# EAGLE design TaaraWeMosBase3 (EAGLE 9.6.2)
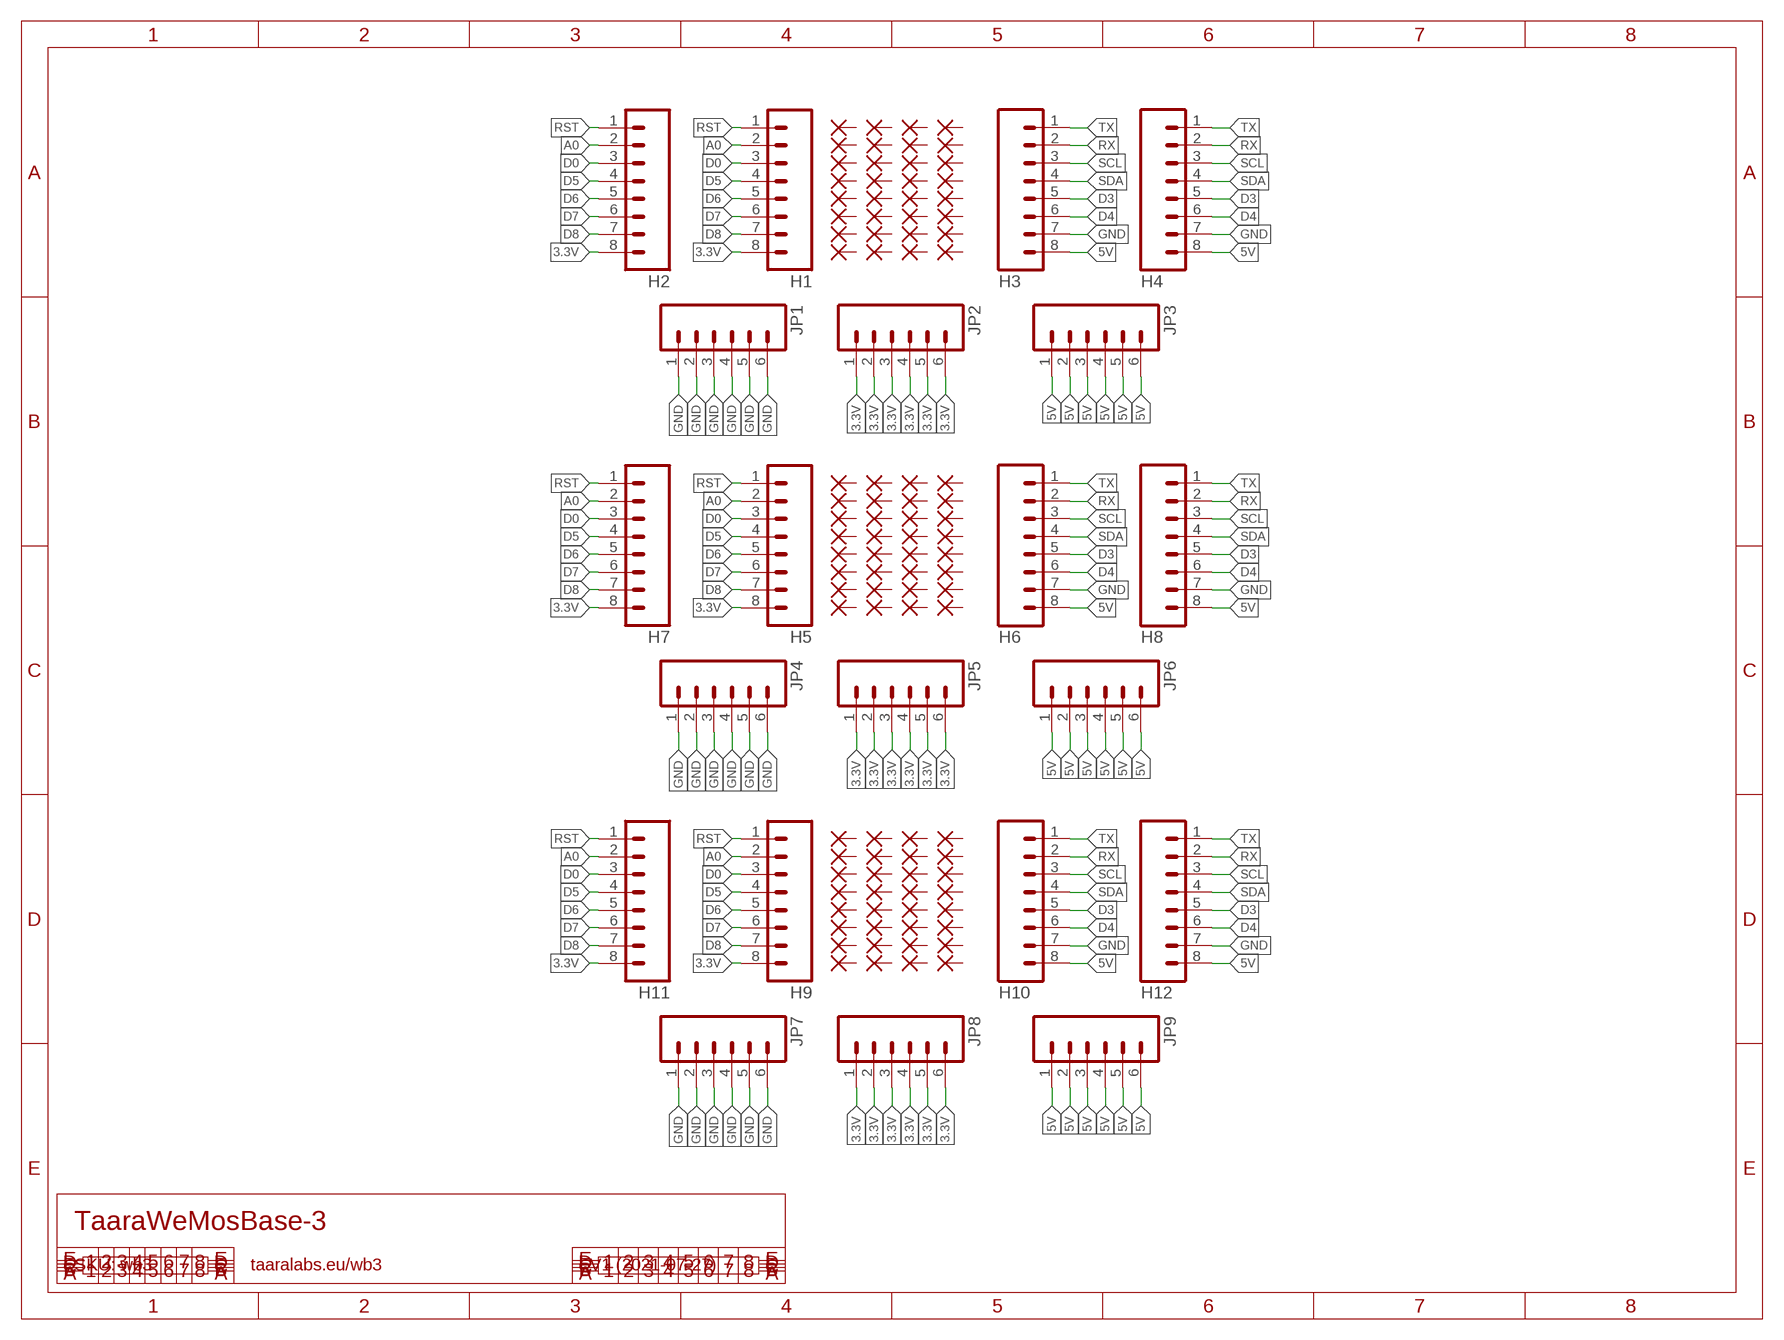
[diagram p0: schematic, sheet 1]

## Parts
H1  M08  [1X08]
H2  M08  [1X08]
H3  M08  [1X08]
H4  M08  [1X08]
H5  M08  [1X08]
H6  M08  [1X08]
H7  M08  [1X08]
H8  M08  [1X08]
H9  M08  [1X08]
H10  M08  [1X08]
H11  M08  [1X08]
H12  M08  [1X08]
JP1  M06SIP  [1X06]
JP2  M06SIP  [1X06]
JP3  M06SIP  [1X06]
JP4  M06SIP  [1X06]
JP5  M06SIP  [1X06]
JP6  M06SIP  [1X06]
JP7  M06SIP  [1X06]
JP8  M06SIP  [1X06]
JP9  M06SIP  [1X06]
PAD1  1,6/0,8  [1,6/0,8]
PAD2  1,6/0,8  [1,6/0,8]
PAD3  1,6/0,8  [1,6/0,8]
PAD4  1,6/0,8  [1,6/0,8]
PAD5  1,6/0,8  [1,6/0,8]
PAD6  1,6/0,8  [1,6/0,8]
PAD7  1,6/0,8  [1,6/0,8]
PAD8  1,6/0,8  [1,6/0,8]
PAD9  1,6/0,8  [1,6/0,8]
PAD10  1,6/0,8  [1,6/0,8]
PAD11  1,6/0,8  [1,6/0,8]
PAD12  1,6/0,8  [1,6/0,8]
PAD13  1,6/0,8  [1,6/0,8]
PAD14  1,6/0,8  [1,6/0,8]
PAD15  1,6/0,8  [1,6/0,8]
PAD16  1,6/0,8  [1,6/0,8]
PAD17  1,6/0,8  [1,6/0,8]
PAD18  1,6/0,8  [1,6/0,8]
PAD19  1,6/0,8  [1,6/0,8]
PAD20  1,6/0,8  [1,6/0,8]
PAD21  1,6/0,8  [1,6/0,8]
PAD22  1,6/0,8  [1,6/0,8]
PAD23  1,6/0,8  [1,6/0,8]
PAD24  1,6/0,8  [1,6/0,8]
PAD25  1,6/0,8  [1,6/0,8]
PAD26  1,6/0,8  [1,6/0,8]
PAD27  1,6/0,8  [1,6/0,8]
PAD28  1,6/0,8  [1,6/0,8]
PAD29  1,6/0,8  [1,6/0,8]
PAD30  1,6/0,8  [1,6/0,8]
PAD31  1,6/0,8  [1,6/0,8]
PAD32  1,6/0,8  [1,6/0,8]
PAD33  1,6/0,8  [1,6/0,8]
PAD34  1,6/0,8  [1,6/0,8]
PAD35  1,6/0,8  [1,6/0,8]
PAD36  1,6/0,8  [1,6/0,8]
PAD37  1,6/0,8  [1,6/0,8]
PAD38  1,6/0,8  [1,6/0,8]
PAD39  1,6/0,8  [1,6/0,8]
PAD40  1,6/0,8  [1,6/0,8]
PAD41  1,6/0,8  [1,6/0,8]
PAD42  1,6/0,8  [1,6/0,8]
PAD43  1,6/0,8  [1,6/0,8]
PAD44  1,6/0,8  [1,6/0,8]
PAD45  1,6/0,8  [1,6/0,8]
PAD46  1,6/0,8  [1,6/0,8]
PAD47  1,6/0,8  [1,6/0,8]
PAD48  1,6/0,8  [1,6/0,8]
PAD49  1,6/0,8  [1,6/0,8]
PAD50  1,6/0,8  [1,6/0,8]
PAD51  1,6/0,8  [1,6/0,8]
PAD52  1,6/0,8  [1,6/0,8]
PAD53  1,6/0,8  [1,6/0,8]
PAD54  1,6/0,8  [1,6/0,8]
PAD55  1,6/0,8  [1,6/0,8]
PAD56  1,6/0,8  [1,6/0,8]
PAD57  1,6/0,8  [1,6/0,8]
PAD58  1,6/0,8  [1,6/0,8]
PAD59  1,6/0,8  [1,6/0,8]
PAD60  1,6/0,8  [1,6/0,8]
PAD61  1,6/0,8  [1,6/0,8]
PAD62  1,6/0,8  [1,6/0,8]
PAD63  1,6/0,8  [1,6/0,8]
PAD64  1,6/0,8  [1,6/0,8]
PAD65  1,6/0,8  [1,6/0,8]
PAD66  1,6/0,8  [1,6/0,8]
PAD67  1,6/0,8  [1,6/0,8]
PAD68  1,6/0,8  [1,6/0,8]
PAD69  1,6/0,8  [1,6/0,8]
PAD70  1,6/0,8  [1,6/0,8]
PAD71  1,6/0,8  [1,6/0,8]
PAD72  1,6/0,8  [1,6/0,8]
PAD73  1,6/0,8  [1,6/0,8]
PAD74  1,6/0,8  [1,6/0,8]
PAD75  1,6/0,8  [1,6/0,8]
PAD76  1,6/0,8  [1,6/0,8]
PAD77  1,6/0,8  [1,6/0,8]
PAD78  1,6/0,8  [1,6/0,8]
PAD79  1,6/0,8  [1,6/0,8]
PAD80  1,6/0,8  [1,6/0,8]
PAD81  1,6/0,8  [1,6/0,8]
PAD82  1,6/0,8  [1,6/0,8]
PAD83  1,6/0,8  [1,6/0,8]
PAD84  1,6/0,8  [1,6/0,8]
PAD85  1,6/0,8  [1,6/0,8]
PAD86  1,6/0,8  [1,6/0,8]
PAD87  1,6/0,8  [1,6/0,8]
PAD88  1,6/0,8  [1,6/0,8]
PAD89  1,6/0,8  [1,6/0,8]
PAD90  1,6/0,8  [1,6/0,8]
PAD91  1,6/0,8  [1,6/0,8]
PAD92  1,6/0,8  [1,6/0,8]
PAD93  1,6/0,8  [1,6/0,8]
PAD94  1,6/0,8  [1,6/0,8]
PAD95  1,6/0,8  [1,6/0,8]
PAD96  1,6/0,8  [1,6/0,8]

## Nets
3.3V: H1.8 H2.8 H5.8 H7.8 H9.8 H11.8 JP2.1 JP2.2 JP2.3 JP2.4 JP2.5 JP2.6 JP5.1 JP5.2 JP5.3 JP5.4 JP5.5 JP5.6 JP8.1 JP8.2 JP8.3 JP8.4 JP8.5 JP8.6
5V: H3.8 H4.8 H6.8 H8.8 H10.8 H12.8 JP3.1 JP3.2 JP3.3 JP3.4 JP3.5 JP3.6 JP6.1 JP6.2 JP6.3 JP6.4 JP6.5 JP6.6 JP9.1 JP9.2 JP9.3 JP9.4 JP9.5 JP9.6
A0: H1.2 H2.2 H5.2 H7.2 H9.2 H11.2
D0: H1.3 H2.3 H5.3 H7.3 H9.3 H11.3
D3: H3.5 H4.5 H6.5 H8.5 H10.5 H12.5
D4: H3.6 H4.6 H6.6 H8.6 H10.6 H12.6
D5: H1.4 H2.4 H5.4 H7.4 H9.4 H11.4
D6: H1.5 H2.5 H5.5 H7.5 H9.5 H11.5
D7: H1.6 H2.6 H5.6 H7.6 H9.6 H11.6
D8: H1.7 H2.7 H5.7 H7.7 H9.7 H11.7
GND: H3.7 H4.7 H6.7 H8.7 H10.7 H12.7 JP1.1 JP1.2 JP1.3 JP1.4 JP1.5 JP1.6 JP4.1 JP4.2 JP4.3 JP4.4 JP4.5 JP4.6 JP7.1 JP7.2 JP7.3 JP7.4 JP7.5 JP7.6
RST: H1.1 H2.1 H5.1 H7.1 H9.1 H11.1
RX: H3.2 H4.2 H6.2 H8.2 H10.2 H12.2
SCL: H3.3 H4.3 H6.3 H8.3 H10.3 H12.3
SDA: H3.4 H4.4 H6.4 H8.4 H10.4 H12.4
TX: H3.1 H4.1 H6.1 H8.1 H10.1 H12.1
Unconnected: PAD1.1(P) PAD2.1(P) PAD3.1(P) PAD4.1(P) PAD5.1(P) PAD6.1(P) PAD7.1(P) PAD8.1(P) PAD9.1(P) PAD10.1(P) PAD11.1(P) PAD12.1(P) PAD13.1(P) PAD14.1(P) PAD15.1(P) PAD16.1(P) PAD17.1(P) PAD18.1(P) PAD19.1(P) PAD20.1(P) PAD21.1(P) PAD22.1(P) PAD23.1(P) PAD24.1(P) PAD25.1(P) PAD26.1(P) PAD27.1(P) PAD28.1(P) PAD29.1(P) PAD30.1(P) PAD31.1(P) PAD32.1(P) PAD33.1(P) PAD34.1(P) PAD35.1(P) PAD36.1(P) PAD37.1(P) PAD38.1(P) PAD39.1(P) PAD40.1(P) PAD41.1(P) PAD42.1(P) PAD43.1(P) PAD44.1(P) PAD45.1(P) PAD46.1(P) PAD47.1(P) PAD48.1(P) PAD49.1(P) PAD50.1(P) PAD51.1(P) PAD52.1(P) PAD53.1(P) PAD54.1(P) PAD55.1(P) PAD56.1(P) PAD57.1(P) PAD58.1(P) PAD59.1(P) PAD60.1(P) PAD61.1(P) PAD62.1(P) PAD63.1(P) PAD64.1(P) PAD65.1(P) PAD66.1(P) PAD67.1(P) PAD68.1(P) PAD69.1(P) PAD70.1(P) PAD71.1(P) PAD72.1(P) PAD73.1(P) PAD74.1(P) PAD75.1(P) PAD76.1(P) PAD77.1(P) PAD78.1(P) PAD79.1(P) PAD80.1(P) PAD81.1(P) PAD82.1(P) PAD83.1(P) PAD84.1(P) PAD85.1(P) PAD86.1(P) PAD87.1(P) PAD88.1(P) PAD89.1(P) PAD90.1(P) PAD91.1(P) PAD92.1(P) PAD93.1(P) PAD94.1(P) PAD95.1(P) PAD96.1(P)

## Notes on the sheet
- TaaraWeMosBase-3
- SKU: wb3 | taaralabs.eu/wb3 | V1 (2021-07-27)

## Library data of the parts
H1-H12 = freetronics-original:M08: Header 8 Standard 8-pin 0.1" header. Use with straight break away headers (SKU : PRT-00116), right angle break away headers (PRT-00553), swiss pins (PRT-00743), machine pins (PRT-00117), and female headers (PRT-00115).
JP1-JP9 = JeeLabs:M06: Header 6 Standard 6-pin 0.1" header. Use with straight break away headers (SKU : PRT-00116), right angle break away headers (PRT-00553), swiss pins (PRT-00743), machine pins (PRT-00117), and female headers (PRT-00115). Molex polarized connector foot print use with SKU : PRT-08094 with associated crimp pins and housings. NOTES ON THE VARIANTS LOCK and LOCK_LONGPADS... This footprint was designed to help hold the alignment of a through-hole component (i.e. 6-pin header) while soldering it into place. You may notice that each hole has been shifted either up or down by 0.005 of an inch from it's more standard position (which is a perfectly straight line). This slight alteration caused the pins (the squares in the middle) to touch the edges of the holes. Because they are alternating, it causes a "brace" to hold the component in place. 0.005 has proven to be the perfect amount of "off-center" position when using our standard breakaway headers. Although looks a little odd when you look at the bare footprint, once you have a header in there, the alteration is very hard to notice. Also, if you push a header all the way into place, it is covered up entirely on the bottom side. This idea of altering the position of holes to aid alignment will be further integrated into the Sparkfun Library for other footprints. It can help hold any component with 3 or more connection pins.
PAD1-PAD96 = JeeLabs:1,6/0,8: THROUGH-HOLE PAD

## Net classes
0 default: width 0.203 mm, drill 0.356 mm, clearance 0.152 mm
1 power: width 0.203 mm, clearance 0.152 mm

## Board
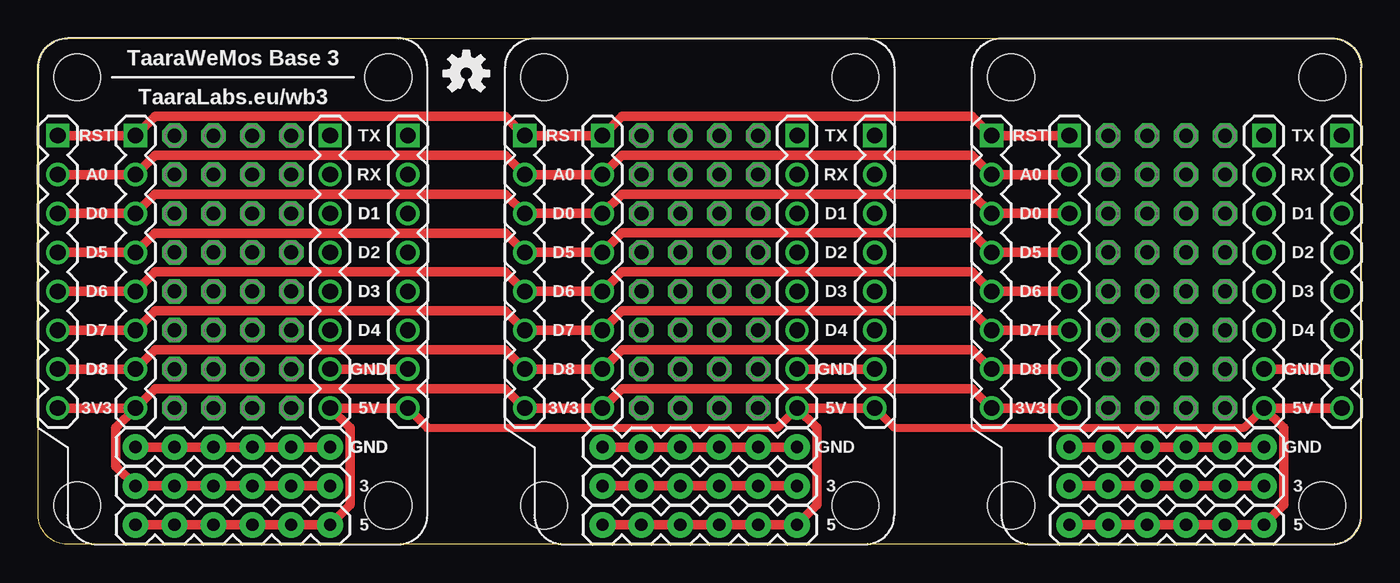
[diagram p1: board, top side]
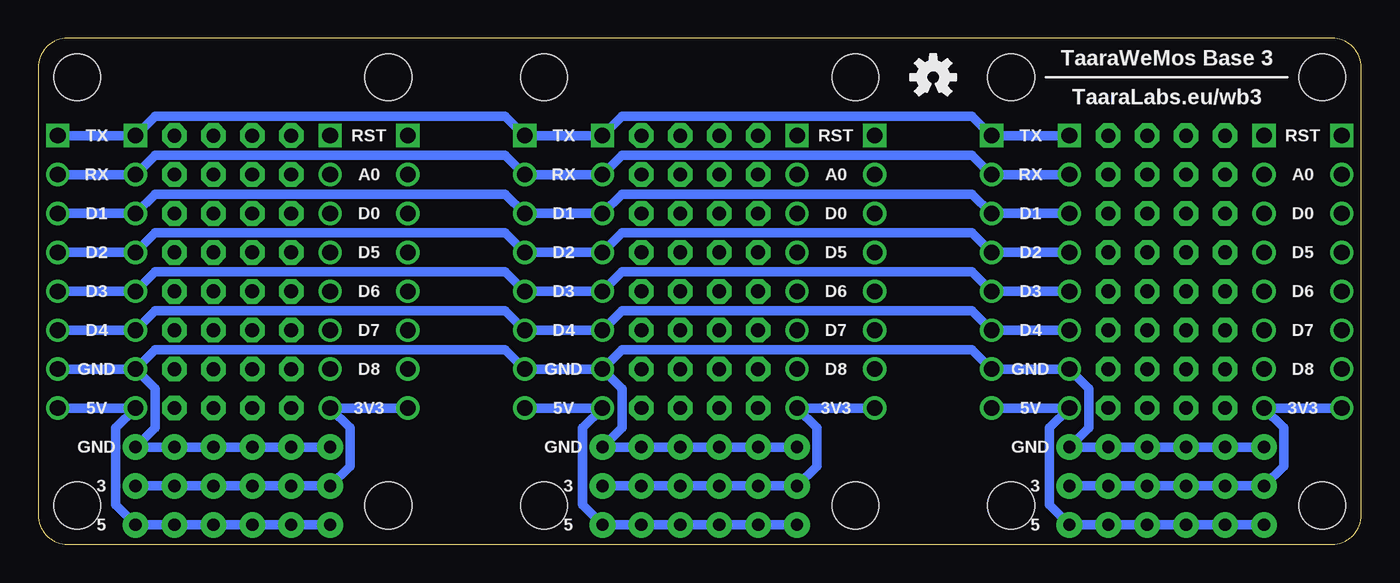
[diagram p2: board, bottom side, seen from below]

Size 86.36 x 33.02 mm. Coordinates in mm from the lower left corner, seen from the top.
Outline: 1.91,33.02 84.45,33.02 arc-90 86.36,31.11 86.36,1.91 arc-90 84.45,0 1.91,0 arc-90 0,1.91 0,31.11 arc-90 1.91,33.02
Copper layers (1*16): Top 0.035mm / dielectric 1.5mm / Bottom 0.035mm
Design rules "ElectroDragon_2layer_DRU_no_angle_20140221": minimum track width 6mil, minimum drill 12mil, track to track 6mil, track to pad 6mil, pad to pad 6mil, via to via 6mil, smd to smd 6mil, copper to edge 8mil, drill to drill 6mil, minimum pad ring 10mil, minimum via ring 6mil, stop-mask expansion 4mil, vias tented up to drill 100mil, thermal gap 10mil
Holes 3.05 mm at 22.86,2.54 53.34,2.54 83.82,2.54 83.82,30.48 53.34,30.48 22.86,30.48 2.54,30.48 33.02,30.48 63.5,30.48 63.5,2.54 33.02,2.54 2.54,2.54

### Footprints (pad centres in the part's own frame; a part is rotated, then mirrored left to right if it is on the bottom)
1X08 = drill 1.016 square: 1 0,0 | drill 1.016: 2 2.54,0; 3 5.08,0; 4 7.62,0; 5 10.16,0; 6 12.7,0; 7 15.24,0; 8 17.78,0
1X06 = drill 0.8 pad 1.676: 1 0,0; 2 2.54,0; 3 5.08,0; 4 7.62,0; 5 10.16,0; 6 12.7,0
1,6/0,8 = drill 0.9 pad 1.6 octagon: 1 0,0

### Placement (x,y rotation side)
H1  1.27,26.67 270 top
H2  6.35,26.67 270 top
H3  24.13,26.67 270 top
H4  19.05,26.67 270 top
H5  31.75,26.67 270 top
H6  54.61,26.67 270 top
H7  36.83,26.67 270 top
H8  49.53,26.67 270 top
H9  62.23,26.67 270 top
H10  85.09,26.67 270 top
H11  67.31,26.67 270 top
H12  80.01,26.67 270 top
JP1  6.35,6.35 0 top
JP2  6.35,3.81 0 top
JP3  6.35,1.27 0 top
JP4  36.83,6.35 0 top
JP5  36.83,3.81 0 top
JP6  36.83,1.27 0 top
JP7  67.31,6.35 0 top
JP8  67.31,3.81 0 top
JP9  67.31,1.27 0 top
PAD1  8.89,26.67 0 top
PAD2  8.89,24.13 0 top
PAD3  8.89,21.59 0 top
PAD4  8.89,19.05 0 top
PAD5  8.89,16.51 0 top
PAD6  8.89,13.97 0 top
PAD7  8.89,11.43 0 top
PAD8  8.89,8.89 0 top
PAD9  11.43,26.67 0 top
PAD10  11.43,24.13 0 top
PAD11  11.43,21.59 0 top
PAD12  11.43,19.05 0 top
PAD13  11.43,16.51 0 top
PAD14  11.43,13.97 0 top
PAD15  11.43,11.43 0 top
PAD16  11.43,8.89 0 top
PAD17  13.97,26.67 0 top
PAD18  13.97,24.13 0 top
PAD19  13.97,21.59 0 top
PAD20  13.97,19.05 0 top
PAD21  13.97,16.51 0 top
PAD22  13.97,13.97 0 top
PAD23  13.97,11.43 0 top
PAD24  13.97,8.89 0 top
PAD25  16.51,26.67 0 top
PAD26  16.51,24.13 0 top
PAD27  16.51,21.59 0 top
PAD28  16.51,19.05 0 top
PAD29  16.51,16.51 0 top
PAD30  16.51,13.97 0 top
PAD31  16.51,11.43 0 top
PAD32  16.51,8.89 0 top
PAD33  39.37,26.67 0 top
PAD34  39.37,24.13 0 top
PAD35  39.37,21.59 0 top
PAD36  39.37,19.05 0 top
PAD37  39.37,16.51 0 top
PAD38  39.37,13.97 0 top
PAD39  39.37,11.43 0 top
PAD40  39.37,8.89 0 top
PAD41  41.91,26.67 0 top
PAD42  41.91,24.13 0 top
PAD43  41.91,21.59 0 top
PAD44  41.91,19.05 0 top
PAD45  41.91,16.51 0 top
PAD46  41.91,13.97 0 top
PAD47  41.91,11.43 0 top
PAD48  41.91,8.89 0 top
PAD49  44.45,26.67 0 top
PAD50  44.45,24.13 0 top
PAD51  44.45,21.59 0 top
PAD52  44.45,19.05 0 top
PAD53  44.45,16.51 0 top
PAD54  44.45,13.97 0 top
PAD55  44.45,11.43 0 top
PAD56  44.45,8.89 0 top
PAD57  46.99,26.67 0 top
PAD58  46.99,24.13 0 top
PAD59  46.99,21.59 0 top
PAD60  46.99,19.05 0 top
PAD61  46.99,16.51 0 top
PAD62  46.99,13.97 0 top
PAD63  46.99,11.43 0 top
PAD64  46.99,8.89 0 top
PAD65  69.85,26.67 0 top
PAD66  69.85,24.13 0 top
PAD67  69.85,21.59 0 top
PAD68  69.85,19.05 0 top
PAD69  69.85,16.51 0 top
PAD70  69.85,13.97 0 top
PAD71  69.85,11.43 0 top
PAD72  69.85,8.89 0 top
PAD73  72.39,26.67 0 top
PAD74  72.39,24.13 0 top
PAD75  72.39,21.59 0 top
PAD76  72.39,19.05 0 top
PAD77  72.39,16.51 0 top
PAD78  72.39,13.97 0 top
PAD79  72.39,11.43 0 top
PAD80  72.39,8.89 0 top
PAD81  74.93,26.67 0 top
PAD82  74.93,24.13 0 top
PAD83  74.93,21.59 0 top
PAD84  74.93,19.05 0 top
PAD85  74.93,16.51 0 top
PAD86  74.93,13.97 0 top
PAD87  74.93,11.43 0 top
PAD88  74.93,8.89 0 top
PAD89  77.47,26.67 0 top
PAD90  77.47,24.13 0 top
PAD91  77.47,21.59 0 top
PAD92  77.47,19.05 0 top
PAD93  77.47,16.51 0 top
PAD94  77.47,13.97 0 top
PAD95  77.47,11.43 0 top
PAD96  77.47,8.89 0 top
U$1  [OSHW-LOGO-S]  27.94,30.73 0 top
U$2  [OSHW-LOGO-S]  27.94,30.48 0 bottom

### Tracks (layer width: path | path; a pad name or v marks a point on that pad's centre or on a via)
3.3V
  Top 0.61: H2.8 7.62,10.16 30.48,10.16 H5.8 H7.8 38.1,10.16 60.96,10.16 H9.8 H11.8 | H1.8 H2.8 | JP2.6 JP2.5 JP2.4 JP2.3 JP2.2 JP2.1 5.05,5.11 5.05,7.59 H2.8 | JP5.1 JP5.2 JP5.3 JP5.4 JP5.5 JP5.6 | JP8.1 JP8.2 JP8.3 JP8.4 JP8.5 JP8.6
  Bottom 0.61: H9.8 H11.8 66.02,7.59 66.02,5.11 JP8.1 JP8.2 JP8.3 JP8.4 JP8.5 JP8.6 | H5.8 H7.8 35.53,7.59 35.53,5.11 JP5.1 JP5.2 JP5.3 JP5.4 JP5.5 JP5.6 | H1.8 H2.8 5.05,7.59 5.05,5.11 JP2.1 JP2.2 JP2.3 JP2.4 JP2.5 JP2.6
5V
  Top 0.508: H6.8 55.88,7.62 78.74,7.62 H12.8 | 25.4,7.62 48.26,7.62 H8.8
  Top 0.61: 25.4,7.62 H3.8 H4.8 20.34,7.59 20.34,2.56 JP3.6 JP3.5 JP3.4 JP3.3 JP3.2 JP3.1 | H6.8 H8.8 50.83,7.59 50.83,2.56 JP6.6 JP6.5 JP6.4 JP6.3 JP6.2 JP6.1 | H10.8 H12.8 81.31,7.59 81.31,2.56 JP9.6 JP9.5 JP9.4 JP9.3 JP9.2 JP9.1
  Bottom 0.61: JP3.1 JP3.2 JP3.3 JP3.4 JP3.5 JP3.6 20.34,2.56 20.34,7.59 H4.8 H3.8 | H6.8 H8.8 50.83,7.59 50.83,2.56 JP6.6 JP6.5 JP6.4 JP6.3 JP6.2 JP6.1 | H10.8 H12.8 81.31,7.59 81.31,2.56 JP9.6 JP9.5 JP9.4 JP9.3 JP9.2 JP9.1
A0
  Top 0.61: H1.2 H2.2 7.62,25.4 30.48,25.4 H5.2 H7.2 38.1,25.4 60.96,25.4 H9.2 H11.2
D0
  Top 0.61: H1.3 H2.3 7.61,22.85 30.47,22.85 30.48,22.86 H5.3 H7.3 38.1,22.86 60.96,22.86 H9.3 H11.3
D3
  Bottom 0.61: H4.5 H3.5 25.4,17.78 48.26,17.78 H8.5 H6.5 55.88,17.78 78.74,17.78 H12.5 H10.5
D4
  Bottom 0.61: H4.6 H3.6 25.4,15.24 48.26,15.24 H8.6 H6.6 55.88,15.24 78.74,15.24 H12.6 H10.6
D5
  Top 0.61: H1.4 H2.4 7.61,20.31 30.47,20.31 30.48,20.32 H5.4 H7.4 38.1,20.32 60.96,20.32 H9.4 H11.4
D6
  Top 0.61: H1.5 H2.5 7.62,17.78 30.48,17.78 H5.5 H7.5 38.1,17.78 60.96,17.78 H9.5 H11.5
D7
  Top 0.61: H1.6 H2.6 7.62,15.24 30.48,15.24 H5.6 H7.6 38.1,15.24 60.96,15.24 H9.6 H11.6
D8
  Top 0.61: H1.7 H2.7 7.62,12.7 30.48,12.7 H5.7 H7.7 38.1,12.7 60.96,12.7 H9.7 H11.7
GND
  Top 0.61: H4.7 H3.7 | H8.7 H6.7 | H12.7 H10.7 | JP1.1 JP1.2 JP1.3 JP1.4 JP1.5 JP1.6 | JP4.1 JP4.2 JP4.3 JP4.4 JP4.5 JP4.6 | JP7.1 JP7.2 JP7.3 JP7.4 JP7.5 JP7.6
  Bottom 0.61: JP1.1 JP1.2 JP1.3 JP1.4 JP1.5 JP1.6 17.78,7.62 17.78,10.16 H4.7 H3.7 25.4,12.7 48.26,12.7 H8.7 | H8.7 H6.7 55.88,12.7 78.74,12.7 H12.7 | JP4.1 JP4.2 JP4.3 JP4.4 JP4.5 JP4.6 48.26,7.62 48.26,10.16 H8.7 | JP7.1 JP7.2 JP7.3 JP7.4 JP7.5 JP7.6 78.74,7.62 78.74,10.16 H12.7 | H12.7 H10.7
RST
  Top 0.61: H1.1 H2.1 7.62,27.94 30.48,27.94 H5.1 H7.1 38.1,27.94 60.96,27.94 H9.1 H11.1
RX
  Bottom 0.61: H4.2 H3.2 25.4,25.4 48.26,25.4 H8.2 H6.2 55.88,25.4 78.74,25.4 H12.2 H10.2
SCL
  Bottom 0.61: H4.3 H3.3 25.4,22.86 48.26,22.86 H8.3 H6.3 55.88,22.86 78.74,22.86 H12.3 H10.3
SDA
  Bottom 0.61: H4.4 H3.4 25.4,20.32 48.26,20.32 H8.4 H6.4 55.88,20.32 78.74,20.32 H12.4 H10.4
TX
  Bottom 0.61: H4.1 H3.1 25.4,27.94 48.26,27.94 H8.1 H6.1 55.88,27.94 78.74,27.94 H12.1 H10.1

### Text on the board
tPlace: TaaraWeMos Base 3 | TaaraLabs.eu/wb3 | RST | TX | RST | TX | RST | TX | A0 | RX | A0 | RX | A0 | RX | D0 | D1 | D1 | D0 | D1 | D0 | D1 | D5 | D2 | D5 | D2 | D5 | D2 | D6 | D3 | D3 | D6 | D3 | D6 | D3 | D7 | D4 | D4 | D7 | D4 | D7 | D4 | D8 | D8 | GND | D8 | GND | D8 | GND | 3V3 | 5V | 3V3 | 3V3 | 5V | 3V3 | 5V | GND | GND | GND | GND | GND | 3 | 3 | 3 | 5 | 5 | 5
bPlace: TaaraWeMos Base 3 | TaaraLabs.eu/wb3 | RST | TX | RST | TX | RST | TX | A0 | RX | A0 | RX | A0 | RX | D0 | D1 | D0 | D1 | D0 | D1 | D5 | D2 | D5 | D2 | D5 | D2 | D6 | D3 | D6 | D3 | D6 | D3 | D7 | D4 | D7 | D4 | D7 | D4 | D8 | GND | D8 | GND | D8 | GND | 3V3 | 5V | 3V3 | 5V | 3V3 | 5V | GND | GND | GND | 3 | 3 | 3 | 5 | 5 | 5